# EAGLE schematic Teensy_backpack (EAGLE 6.6.0)
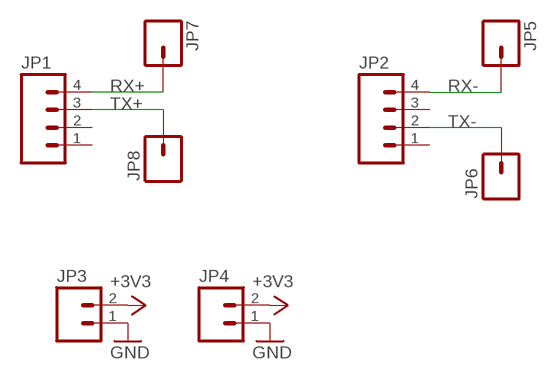
[diagram p0: schematic, sheet 1]

## Parts
JP1  M04NO_SILK_ALL_ROUND  [1X04_NO_SILK_ALL_ROUND]
JP2  M04NO_SILK_ALL_ROUND  [1X04_NO_SILK_ALL_ROUND]
JP3  M021X02_NO_SILK  [1X02_NO_SILK]
JP4  M021X02_NO_SILK  [1X02_NO_SILK]
JP5  M01NOSILK-KIT  [1X01NS-KIT]
JP6  M01NOSILK-KIT  [1X01NS-KIT]
JP7  M01NOSILK-KIT  [1X01NS-KIT]
JP8  M01NOSILK-KIT  [1X01NS-KIT]

## Nets
+3V3: JP3.2 JP4.2
GND: JP3.1 JP4.1
RX+: JP1.4 JP7.1
RX-: JP2.4 JP5.1
TX+: JP1.3 JP8.1
TX-: JP2.2 JP6.1
Unconnected: JP1.1 JP1.2 JP2.1 JP2.3

## Library data of the parts
JP1 JP2 = SparkFun-Connectors:M04: Header 4 Standard 4-pin 0.1" header. Use with straight break away headers (SKU : PRT-00116), right angle break away headers (PRT-00553), swiss pins (PRT-00743), machine pins (PRT-00117), and female headers (PRT-00115). Molex polarized connector foot print use with SKU : PRT-08231 with associated crimp pins and housings. 1MM SMD Version SKU: PRT-10208
JP3 JP4 = SparkFun-Connectors:M02: Standard 2-pin 0.1" header. Use with - straight break away headers ( PRT-00116) - right angle break away headers (PRT-00553) - swiss pins (PRT-00743) - machine pins (PRT-00117) - female headers (PRT-00115) Molex polarized connector foot print use with: PRT-08233 with associated crimp pins and housings. 2.54_SCREWTERM for use with PRT-10571. 3.5mm Screw Terminal footprints for PRT-08084 5mm Screw Terminal footprints for use with PRT-08432
JP5-JP8 = SparkFun-Connectors:M01: Header 1 Standard 1-pin 0.1" header. Use with straight break away headers (SKU : PRT-00116), right angle break away headers (PRT-00553), swiss pins (PRT-00743), machine pins (PRT-00117), and female headers (PRT-00115). SMTSO-256-ET is a "flush mount" nut for a 4-40 screw. The older package used to be too tight, and did not allow it to sit properly thru the drill hit. The latest (0.165DIA) fits nice and snug.